# EAGLE design HVIBDC (EAGLE 9.1.3)
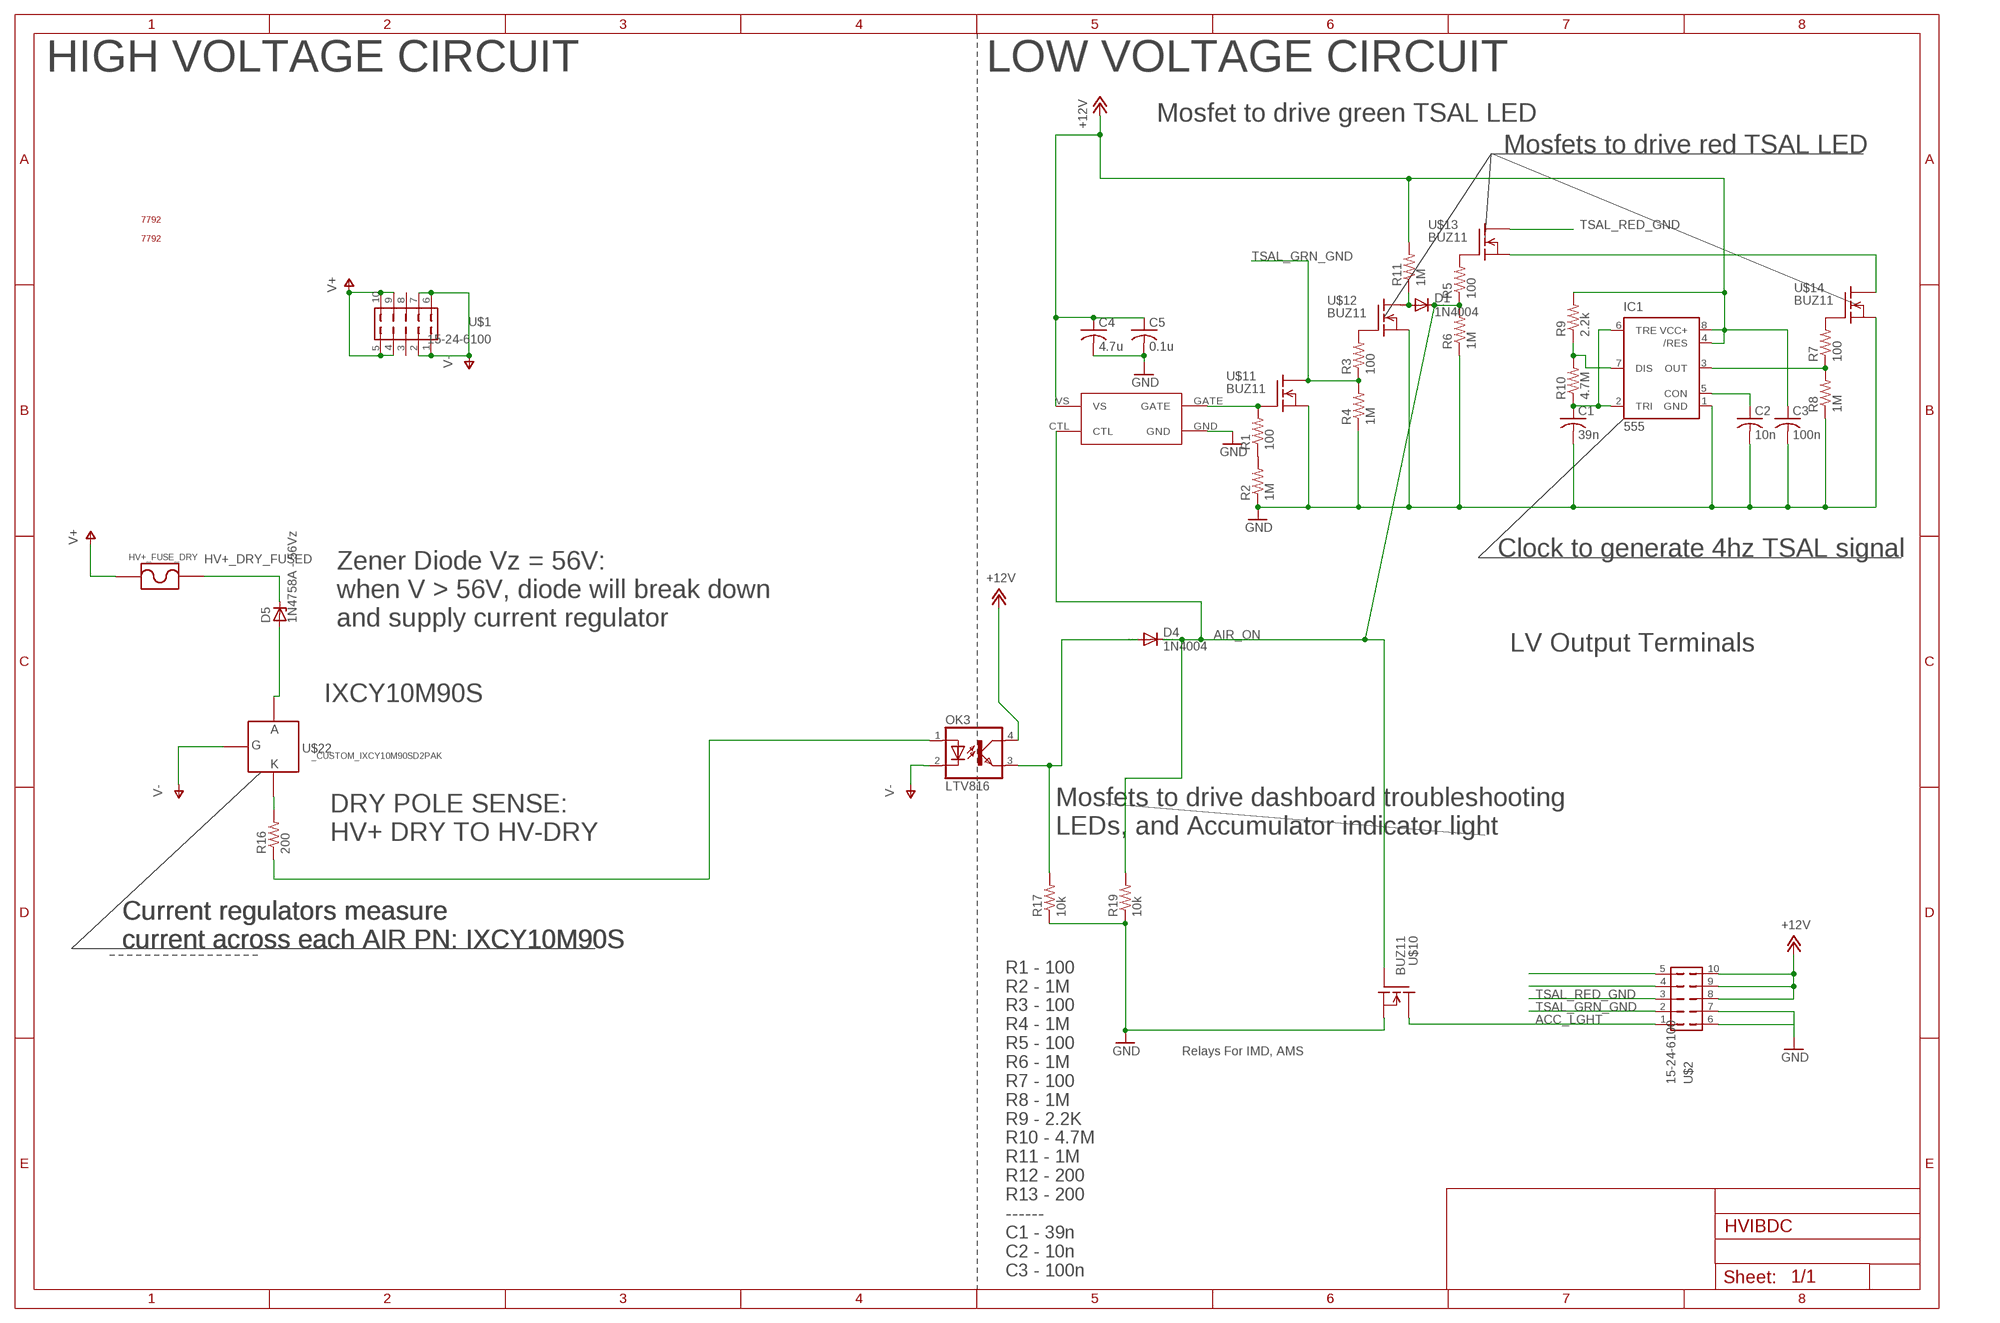
[diagram p0: schematic, sheet 1]

## Parts
C1  39n  C-USC0805  [C0805]
C2  10n  C-USC0805  [C0805]
C3  100n  C-USC0805  [C0805]
C4  4.7u  C-USC0805  [C0805]
C5  0.1u  C-USC0805  [C0805]
D1  1N4004  [DO41-10]
D4  1N4004  [DO41-10]
D5  1N4758A - 56Vz  ZENER-DIODEZD-12.5  [ZDIO12.5]
HV+_FUSE_DRY  _CUSTOM_PARTS_LF_885  [_CUSTOM_PARTS_LF_885]
IC1  555  555P  [DIP08]
OK3  LTV816  [DIL04]
R1  100  R-US_R0805  [R0805]
R2  1M  R-US_R0805  [R0805]
R3  100  R-US_R0805  [R0805]
R4  1M  R-US_R0805  [R0805]
R5  100  R-US_R0805  [R0805]
R6  1M  R-US_R0805  [R0805]
R7  100  R-US_R0805  [R0805]
R8  1M  R-US_R0805  [R0805]
R9  2.2k  R-US_R0805  [R0805]
R10  4.7M  R-US_R0805  [R0805]
R11  1M  R-US_R0805  [R0805]
R16  200  R-US_R2010  [R2010]
R17  10k  R-US_R0805  [R0805]
R19  10k  R-US_R0805  [R0805]
U$1  15-24-6100  [15-24-6100]
U$2  15-24-6100  [15-24-6100]
U$3  7792  [7792]
U$4  7792  [7792]
U$10  BUZ11  [TO220]
U$11  BUZ11  [TO220]
U$12  BUZ11  [TO220]
U$13  BUZ11  [TO220]
U$14  BUZ11  [TO220]
U$15  MIC4417  [PDM_2019_REVB_MIC4416YM4-TR]
U$22  _CUSTOM_IXCY10M90SD2PAK  [TO228P991X238-3]

## Nets
+12V: C3.1 C4.1 C5.1 IC1.4(/RES) IC1.8(VCC+) OK3.4(COL) R9.2 R11.2 U$2.8 U$2.9 U$2.10 U$15.VS
ACC_LGHT [LV]: U$2.1 U$10.2(D)
AIR_ON: D1.C D4.C R5.1 R6.2 R19.2 U$10.1(G) U$15.CTL
GND: C1.2 C2.2 C3.2 C4.2 C5.2 IC1.1(GND) R2.1 R4.1 R6.1 R8.1 R17.1 R19.1 U$2.7 U$10.3(S) U$11.3(S) U$12.3(S) U$14.3(S) U$15.GND
HV+_DRY_FUSED [LV]: D5.C HV+_FUSE_DRY.P$1
N$1: R1.1 R2.2
N$2: R1.2 U$11.1(G) U$15.GATE
N$3: R3.2 U$12.1(G)
N$4: C2.1 IC1.5(CON)
N$5: IC1.7(DIS) R9.1 R10.2
N$6: R5.2 U$13.1(G)
N$7: R7.2 U$14.1(G)
N$8: IC1.3(OUT) R7.1 R8.2
N$9: C1.1 IC1.2(TRI) IC1.6(TRE) R10.1
N$12: U$2.4
N$13: U$13.3(S) U$14.2(D)
N$14: D4.A OK3.3(EMIT) R17.2
N$15: D1.A R11.1 U$12.2(D)
N$16: U$2.5
N$20: R16.2 U$22.2(K)
N$21: D5.A U$22.3(A)
N$22: OK3.1(A) R16.1
N$24: U$2.6
TSAL_GRN_GND [LV]: R3.1 R4.2 U$2.2 U$11.2(D)
TSAL_RED_GND [LV]: U$2.3 U$13.2(D)
V+ [LV]: HV+_FUSE_DRY.P$2 U$1.4 U$1.5 U$1.9 U$1.10
V- [LV]: OK3.2(C) U$1.1 U$1.2 U$1.6 U$1.7 U$22.1(G)
Unconnected: U$1.3 U$1.8

## Notes on the sheet
- HIGH VOLTAGE CIRCUIT | LOW VOLTAGE CIRCUIT
- Mosfet to drive green TSAL LED
- Mosfets to drive red TSAL LED
- Clock to generate 4hz TSAL signal
- Zener Diode Vz = 56V: 
  when V > 56V, diode will break down 
  and supply current regulator
- LV Output Terminals
- IXCY10M90S
- Mosfets to drive dashboard troubleshooting
  LEDs, and Accumulator indicator light
- DRY POLE SENSE:
  HV+ DRY TO HV-DRY
- Current regulators measure 
  current across each AIR PN: IXCY10M90S
- Current regulators measure 
  current across each AIR PN: IXCY10M90S
- Current regulators measure 
  current across each AIR PN: IXCY10M90S
- Relays For IMD, AMS
- R1 - 100
  R2 - 1M
  R3 - 100
  R4 - 1M
  R5 - 100
  R6 - 1M
  R7 - 100
  R8 - 1M
  R9 - 2.2K
  R10 - 4.7M
  R11 - 1M
  R12 - 200
  R13 - 200
  ------
  C1 - 39n
  C2 - 10n
  C3 - 100n

## Library data of the parts
C1-C5 = resistor:C-US: CAPACITOR, American symbol
D1 D4 = diode:1N4004: DIODE general purpose rectifier, 1 A
D5 = Main:ZENER-DIODE: Z-Diode
HV+_FUSE_DRY = Main:_CUSTOM_PARTS_LF_885
IC1 = SparkFun-IC-Special-Function:555: General purpose bipolar Timer Datasheet <http://www.sparkfun.com/datasheets/Components/General/ne555.pdf> SparkFun Products SparkFun SparkPunk Sequencer Kit <https://www.sparkfun.com/products/12707> (KIT-12707) Storefront Component: 555 Timer <https://www.sparkfun.com/products/9273> (COM-09273) Two parts valid for production: VFP: IC-11930 (M7555 PTH) VFP: IC-09173 (555 PTH) - Preferred; PROD_ID: IC-09173; PROD_ID_ALT: IC-09173
OK3 = optocoupler:LTV816: OPTO COUPLER Source: LITEON, LTV816.pdf; OC_FARNELL: unknown; OC_NEWARK: unknown
R1-R11 R17 R19 = resistor:R-US_: RESISTOR, American symbol
R16 = Main:R-US_: RESISTOR, American symbol; SPICEPREFIX: R
U$1 U$2 = ACC-MB-R0:15-24-6100
U$3 U$4 = ACC-MB-R0:7792
U$10-U$14 = transistor-fet:BUZ11: N-Channel Enhancement MOSFET 50V; 30A; 0,040Ohm
U$15 = HVIB_v2:MIC4417; MPN: MIC4417
U$22 = Main:_CUSTOM_IXCY10M90S

## Net classes
0 default: width 1 mm, clearance 0.152 mm
1 LV: clearance 0.001 mm

## Board
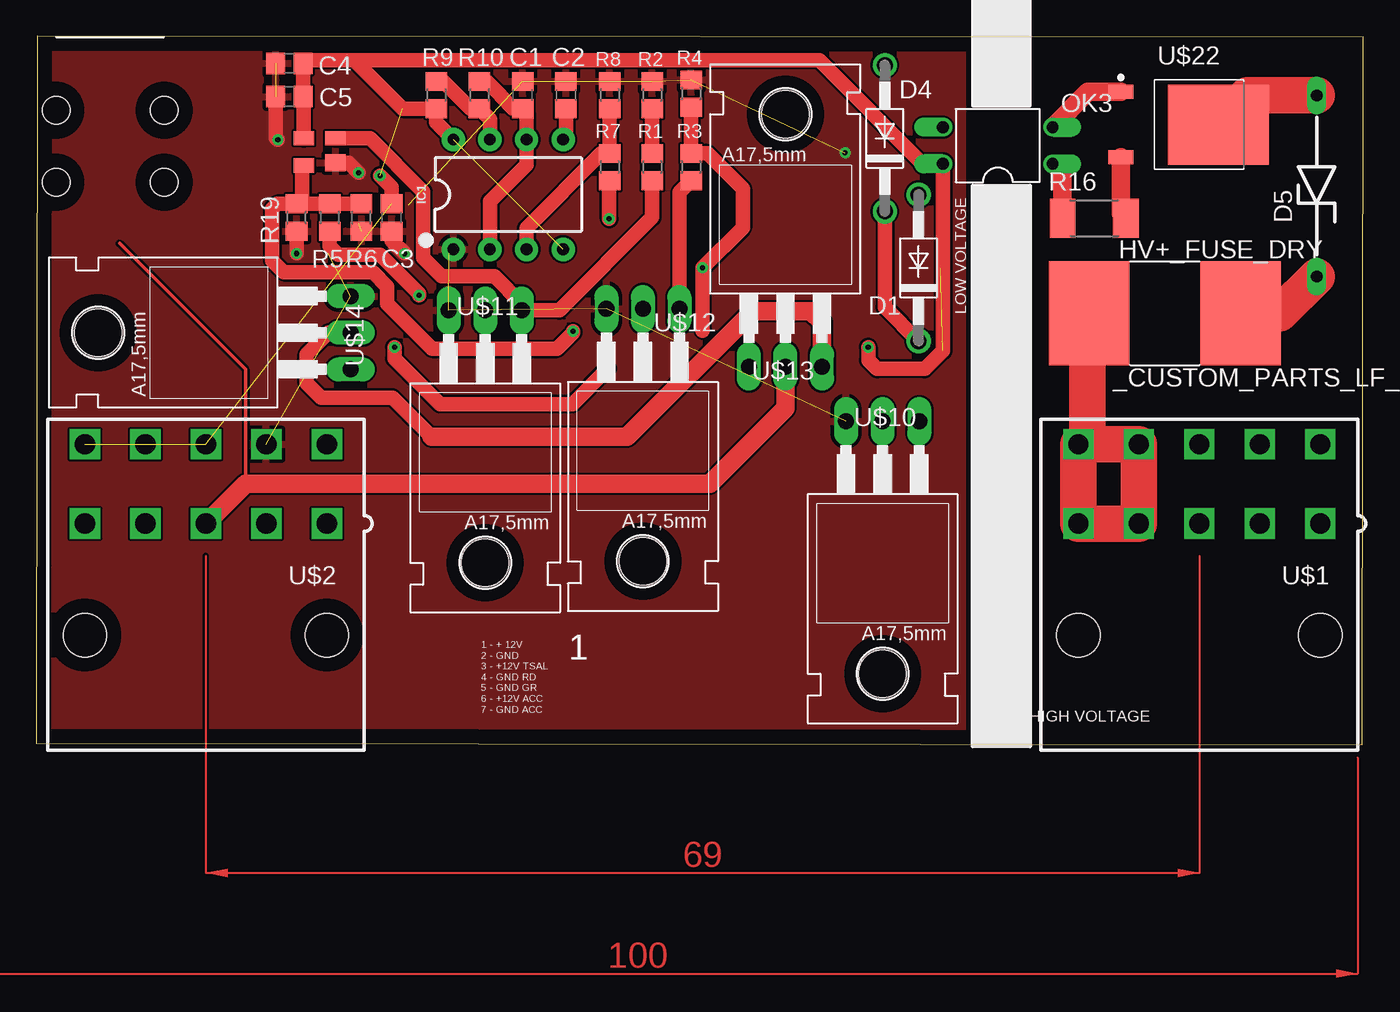
[diagram p1: board, top side]
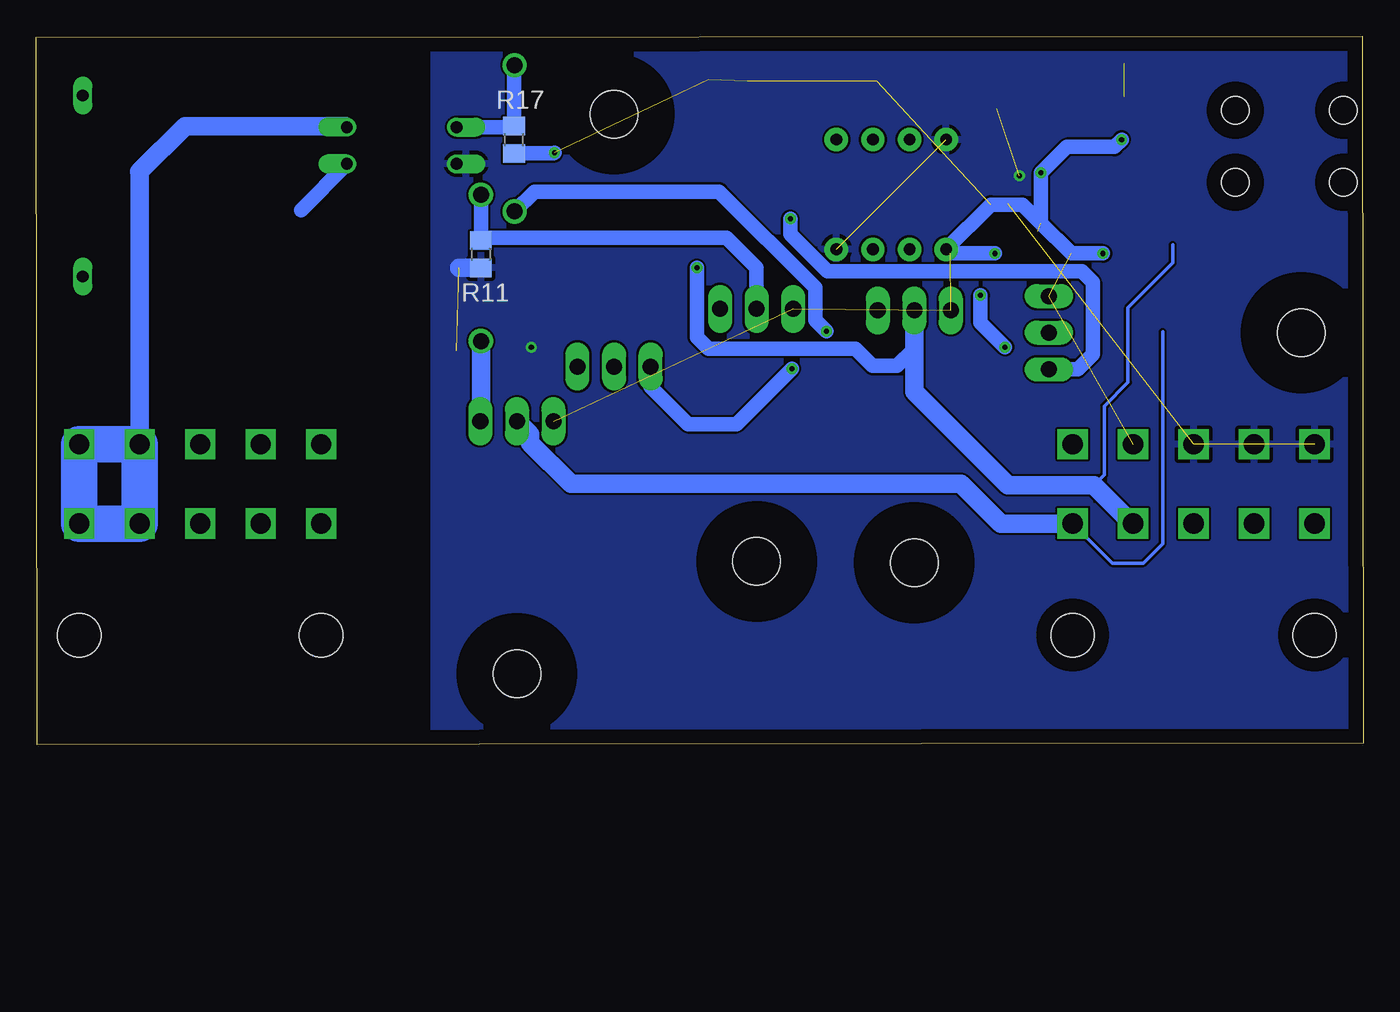
[diagram p2: board, bottom side, seen from below]

Size 92.2 x 49.2 mm. Coordinates in mm from the lower left corner, seen from the top.
Outline: 0,0.1 92.1,0 92.2,49.1 0.1,49.2 0,0.1
Copper layers (1*16): Top 0.035mm / dielectric 1.5mm / Bottom 0.035mm
Design rules "default": minimum track width 6mil, minimum drill 0.35mm, track to track 6mil, track to pad 6mil, pad to pad 6mil, via to via 6mil, smd to smd 6mil, copper to edge 40mil, drill to drill 6mil, minimum pad ring 10mil, minimum via ring 8mil, stop-mask expansion 4mil, vias tented up to drill 0mil, thermal gap 10mil
tRestrict: area 65,-0.5 to 69,52.1
bRestrict: area 65,-0.3 to 69,52.1

### Footprints (pad centres in the part's own frame; a part is rotated, then mirrored left to right if it is on the bottom)
C0805 = smd 1.3 x 1.5: 1 -0.95,0; 2 0.95,0
DO41-10 = drill 1.118: A 5.08,0; C -5.08,0
ZDIO12.5 = drill 0.813 long: A 6.223,0; C -6.35,0
_CUSTOM_PARTS_LF_885 = smd 5.6 x 7.23: P$1 5.25,0; P$2 -5.25,0
DIP08 = drill 0.813 pad 1.626: 1 -3.81,-3.81; 2 -1.27,-3.81; 3 1.27,-3.81; 4 3.81,-3.81; 5 3.81,3.81; 6 1.27,3.81; 7 -1.27,3.81; 8 -3.81,3.81
DIL04 = drill 0.813 offset: 1 -1.27,-3.81; 2 1.27,-3.81; 3 1.27,3.81; 4 -1.27,3.81
R0805 = smd 1.3 x 1.5: 1 -0.95,0; 2 0.95,0
R2010 = smd 1.8 x 2.7: 1 -2.2,0; 2 2.2,0
15-24-6100 = drill 1.4 square: 1 8.4,-2.75; 2 4.2,-2.75; 3 0,-2.75; 4 -4.2,-2.75; 5 -8.4,-2.75; 6 8.4,2.75; 7 4.2,2.75; 8 0,2.75; 9 -4.2,2.75; 10 -8.4,2.75 | hole 3: 8.4,-10.5; -8.4,-10.5
7792 = hole 1.9: 0,5; 0,0; 7.5,0; 7.5,5
TO220 = drill 1.118 long: 1 -2.54,-6.35; 2 0,-6.35; 3 2.54,-6.35 | hole 3.302: 0,11.176
PDM_2019_REVB_MIC4416YM4-TR = smd 1 x 1.44: CTL 0,0; GATE 1.9,-2.2; VS 1.9,0 | smd 1.2 x 1.44: GND 0.2,-2.2
TO228P991X238-3 = smd 1.718 x 0.974: 1 -4.704,2.28; 2 -4.704,-2.28 | smd 7.001 x 5.544: 3 2.063,0

### Placement (x,y rotation side)
C1  33.8,45.1 90 top
C2  36.8,45.1 90 top
C3  24.7,36.6 270 top
C4  17.6,47.3 180 top
C5  17.6,45 180 top
D1  61.3,33.1 90 top
D4  58.95,42.1 90 top
D5  88.95,38.85 90 top
HV+_FUSE_DRY  78.4,29.95 0 top
IC1  32.8,38.2 0 top
OK3  66.8,41.6 90 top
R1  42.8,40.1 270 top
R2  42.8,45.1 270 top
R3  45.5,40.1 270 top
R4  45.5,45.2 270 top
R5  20.4,36.6 270 top
R6  22.6,36.6 90 top
R7  39.85,40.1 270 top
R8  39.85,45.1 270 top
R9  27.8,45.1 270 top
R10  30.8,45.1 270 top
R11  61.3,34.05 270 bottom
R16  73.5,36.55 0 top
R17  59,42 90 bottom
R19  18.1,36.6 90 top
U$1  80.8,18.1 0 top
U$2  11.8,18.1 0 top
U$3  -27.9,-16.85 0 top  (outside the outline)
U$4  1.4,39.05 0 top
U$10  58.8,16.1 180 top
U$11  31.2,23.8 180 top
U$12  42.15,23.9 180 top
U$13  52.05,32.6 0 top
U$14  15.5,28.6 90 top
U$15  18.6,40.2 90 top
U$22  80.05,43.05 0 top

### Tracks (layer width: path | path; a pad name or v marks a point on that pad's centre or on a via)
+12V  (via drill 0.35)  (6 unrouted)
  Top 1: IC1.8 27.8,43.2 R9.2 25.45,44.15 22.1,47.5 | U$15.VS 18.6,44.95 C5.1 C4.1 18.75,47.5 22.1,47.5 | C3.1 24.7,38.7 v23.9,39.5 | 22.1,47.5 54.42,47.5 61.61,40.31 62.97,40.31 OK3.4 62.99,27.34 61.74,26.08 58.41,26.08 57.8,26.7 v57.8,27.6
  Bottom 1.27: R11.2 62.8,33.1
  pour Bottom: -9.1,54.2 64.6,54.2 64.6,-0.9 -9.1,-0.9
ACC_LGHT
  Bottom 0.254: U$2.1 17.45,12.6 15.3,12.6 13.95,13.95 13.95,28.65
  Bottom 1.27: U$10.2 57.89,21.54 57.89,20.94 55.05,18.1 27.95,18.1 25.2,15.35 U$2.1
AIR_ON  (via drill 0.35)
  Top 1: R19.2 R5.1 R6.2 | R19.2 18.5,37.95 18.5,40.2 U$15.CTL | D4.C 58.95,30.37 D1.C | R19.2 16.77,37.55 16.42,37.2 16.42,33.6 17.22,32.8 23.4,32.8 24.4,31.8 24.4,30.6 27.5,27.5 36.2,27.5 37.3,28.6 v37.3,28.7
  Bottom 1: v37.3,28.7 38.07,29.47 38.07,31.73 44.75,38.4 57.57,38.4 D4.C
  Bottom 1.27: D1.C 61.3,22.49 U$10.1
GND  (via drill 0.35)  (13 unrouted)
  Top 1: U$15.GND 21.7,40.4 v22.4,39.7 | C5.2 16.65,42.15 v16.8,42 | R19.1 v18.1,34.1 | C3.2 24.7,35 v25.6,34.1
  Bottom 1: 22.4,36.2 v22.4,39.7 20.6,41.5 17.3,41.5 v16.8,42 | R17.1 56.25,41.05 v56.2,41.1 | v18.1,34.1 20.3,34.1 22.4,36.2 | 22.4,36.2 23.7,37.5 25.88,37.5 IC1.1 28.7,34.1 v25.6,34.1
  pour Top: -9.2,53 64.35,53 64.35,-0.9 -9.2,-0.9
HV+_DRY_FUSED
  Top 2.54: HV+_FUSE_DRY.P$1 86.4,29.95 D5.C
N$1
  Top 1: R2.2 R1.1
N$2
  Top 1: R1.2 42.8,36.6 36.35,30.15 U$11.1 33.74,30.62 31.84,32.53 28.17,32.53 26.9,33.8 26.9,38.4 23.2,42.1 U$15.GATE
N$3
  Top 1: R3.2 44.7,38.35 U$12.1
N$4
  Top 1: C2.1 36.8,42.2 IC1.5
N$5
  Top 1: R9.1 28.29,46.05 30.19,44.15 R10.2 31.53,43.42 IC1.7
N$6  (via drill 0.35)
  Top 1: v39.7,26.1 37.25,23.65 28.05,23.65 24.9,26.8 v24.9,27.6 | v26.6,31.2 26.6,31.3 23.9,34 21,34 20.4,34.6 R5.2
  Bottom 1: U$13.1 49.51,24.86 46.9,22.25 43.55,22.25 v39.7,26.1 | v24.9,27.6 26.6,29.3 v26.6,31.2
N$7  (via drill 0.35)
  Top 1: v39.8,36.5 39.8,39.1 R7.2
  Bottom 1: v39.8,36.5 39.8,35.44 37.24,32.88 19.58,32.88 18.8,32.1 18.8,27.1 19.84,26.06 U$14.1
N$8
  Top 1: R8.2 R7.1 39.25,41.05 34.07,35.87 IC1.3
N$9
  Top 1: R10.1 31.29,46.05 32.25,45.09 32.25,45.05 33.15,44.15 C1.1 34.07,43.88 IC1.6 34.07,40.27 31.53,37.73 IC1.2
N$13
  Top 1: 27.49,21.36 24.75,24.1 19.8,24.1 18.8,25.1 18.8,27.1 20.3,28.6 U$14.2
  Top 1.27: U$13.3 54.59,29.31 53.8,30.1 49.8,30.1 41.06,21.36 27.49,21.36
N$14
  Bottom 1: D4.A 59,47.13 R17.2 59.08,42.87 OK3.3
N$15
  Bottom 1: D1.A R11.1 61.1,35.2 44.23,35.2 42.15,33.12 U$12.2
N$20
  Top 1.27: R16.2 75.35,36.9 U$22.2
N$21
  Top 2.54: D5.A 84.14,45.07 U$22.3
N$22
  Top 1.27: OK3.1 71.3,39.64 R16.1
  Bottom 1: 73.8,37.1 70.61,40.29 OK3.1
TSAL_GRN_GND  (via drill 0.35)
  Top 1: R4.2 R3.1 46.65,41.05 49.1,38.6 49.1,35.9 v46.3,33.1 46.3,28.75
  Bottom 0.254: 18.71,18.01 18,18.73 18,23.5 16.35,25.15 16.35,30.35 13.25,33.45 13.25,34.7
  Bottom 1: U$11.2 31.2,27.5 32.4,26.3 34.1,26.3 35.3,27.5 45.5,27.5 46.3,28.3 v46.3,33.1
  Bottom 1.27: U$11.2 31.2,24.5 24.71,18.01 18.71,18.01 16.05,15.35 U$2.2
TSAL_RED_GND
  Top 0.254: 14.55,18.1 14.55,26.05 5.8,34.8
  Top 1.27: U$2.3 14.55,18.1 46.8,18.1 52.05,23.35 U$13.2
V+
  Top 2.54: HV+_FUSE_DRY.P$2 73.04,29.84 73.04,21.49 U$1.10 | U$1.10 U$1.9 U$1.4 U$1.5 U$1.10
V-
  Top 1.27: OK3.2 73.07,45.33 U$22.1
  Bottom 1.27: OK3.2 70.69,42.95 81.85,42.95 85.02,39.78 85,39.76 85,37.1 U$1.7
  Bottom 2.54: U$1.7 U$1.2 U$1.1 U$1.6 U$1.7
(copper drawn outside any net)
  shapes: Top area x3

### Text on the board
tPlace: LOW VOLTAGE | 1 | 1 - + 12V / 2 - GND / 3 - +12V TSAL / 4 - GND RD / 5 - GND GR / 6 - +12V ACC / 7 - GND ACC | HIGH VOLTAGE | HIGH VOLTAGE